# Altium schematic sheet Connectors.SchDoc
size A4; SheetNumber: 1; SheetTotal: 1
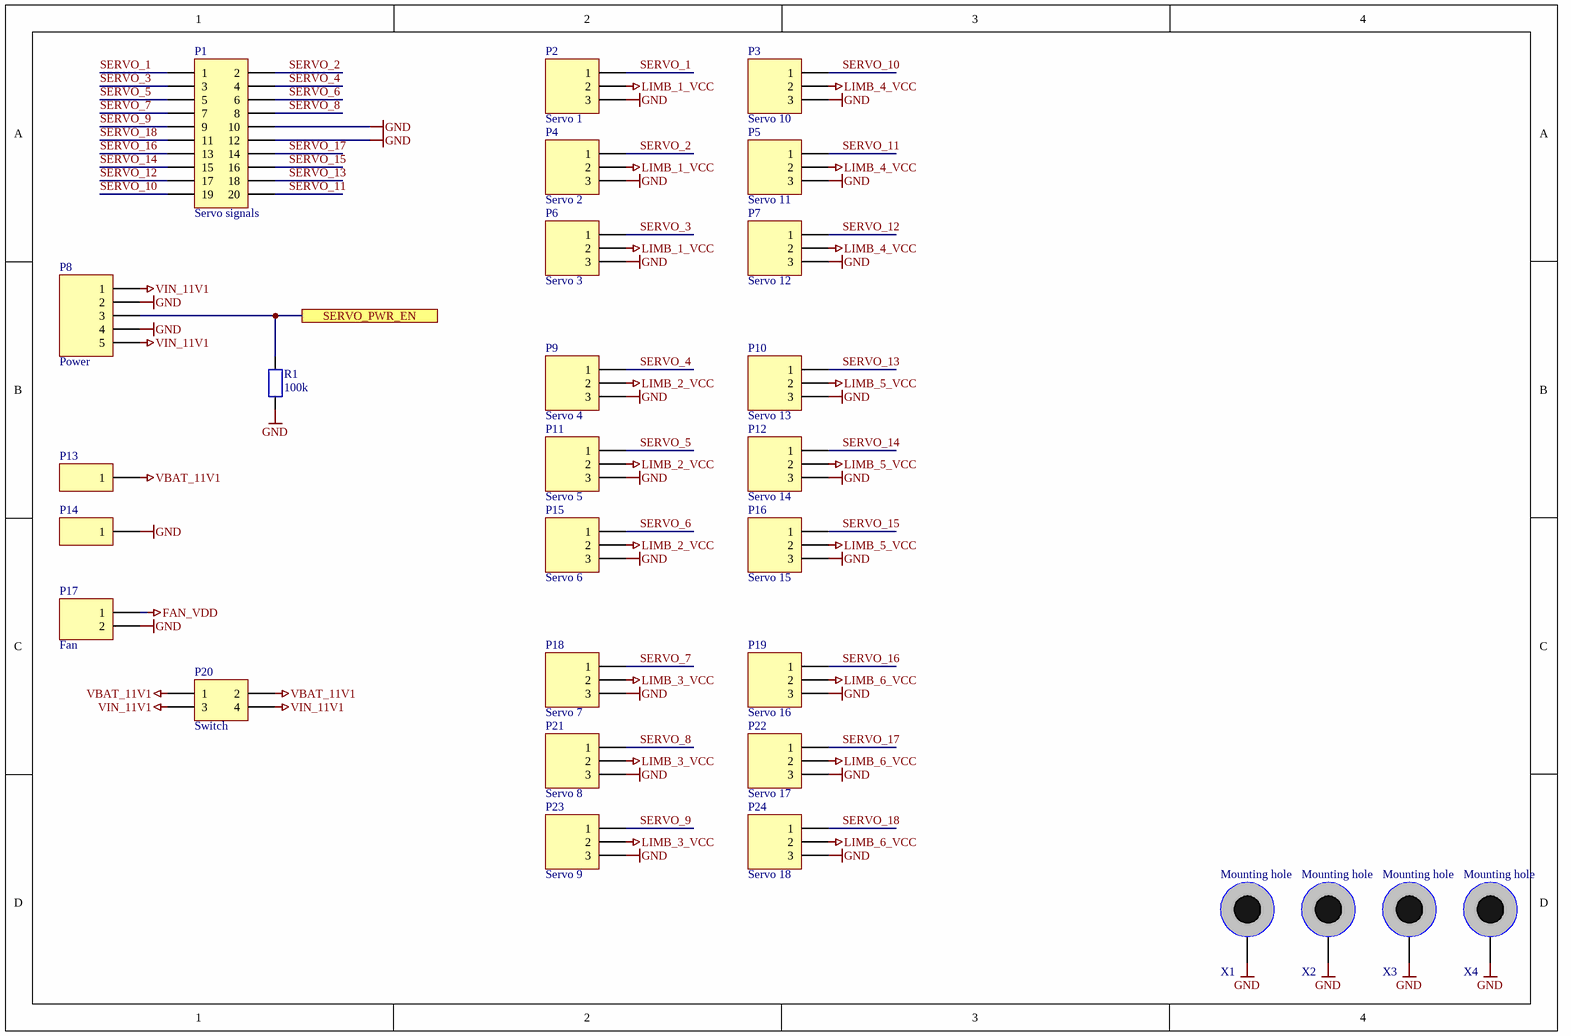
[diagram p0: Connectors.SchDoc]

## Parts
P1  Servo signals  [IDC-20]
P2  Servo 1  [PLS-3 2.54]
P3  Servo 10  [PLS-3 2.54]
P4  Servo 2  [PLS-3 2.54]
P5  Servo 11  [PLS-3 2.54]
P6  Servo 3  [PLS-3 2.54]
P7  Servo 12  [PLS-3 2.54]
P8  Power  [PLS-5 2.54]
P9  Servo 4  [PLS-3 2.54]
P10  Servo 13  [PLS-3 2.54]
P11  Servo 5  [PLS-3 2.54]
P12  Servo 14  [PLS-3 2.54]
P13  (no value)  [WIRE_SMD_5X5]
P14  (no value)  [WIRE_SMD_5X5]
P15  Servo 6  [PLS-3 2.54]
P16  Servo 15  [PLS-3 2.54]
P17  Fan  [PLS-2 2.54]
P18  Servo 7  [PLS-3 2.54]
P19  Servo 16  [PLS-3 2.54]
P20  Switch  [PLD-2 2.54]
P21  Servo 8  [PLS-3 2.54]
P22  Servo 17  [PLS-3 2.54]
P23  Servo 9  [PLS-3 2.54]
P24  Servo 18  [PLS-3 2.54]
R1  100k  [R_0603/1608]
X1  Mounting hole  [HOLE_M3_D6.0/3.5]  (no BOM)
X2  Mounting hole  [HOLE_M3_D6.0/3.5]  (no BOM)
X3  Mounting hole  [HOLE_M3_D6.0/3.5]  (no BOM)
X4  Mounting hole  [HOLE_M3_D6.0/3.5]  (no BOM)

## Ports
SERVO_PWR_EN

## Nets
FAN_VDD: P17.1
GND: P1.10 P1.12 P2.3 P3.3 P4.3 P5.3 P6.3 P7.3 P8.2 P8.4 P9.3 P10.3 P11.3 P12.3 P14.1 P15.3 P16.3 P17.2 P18.3 P19.3 P21.3 P22.3 P23.3 P24.3 R1.2 X1.1 X2.1 X3.1 X4.1
LIMB_1_VCC: P2.2 P4.2 P6.2
LIMB_2_VCC: P9.2 P11.2 P15.2
LIMB_3_VCC: P18.2 P21.2 P23.2
LIMB_4_VCC: P3.2 P5.2 P7.2
LIMB_5_VCC: P10.2 P12.2 P16.2
LIMB_6_VCC: P19.2 P22.2 P24.2
VBAT_11V1: P13.1 P20.1 P20.2
VIN_11V1: P8.1 P8.5 P20.3 P20.4
SERVO_1: P1.1 P2.1
SERVO_2: P1.2 P4.1
SERVO_3: P1.3 P6.1
SERVO_4: P1.4 P9.1
SERVO_5: P1.5 P11.1
SERVO_6: P1.6 P15.1
SERVO_7: P1.7 P18.1
SERVO_8: P1.8 P21.1
SERVO_9: P1.9 P23.1
SERVO_10: P1.19 P3.1
SERVO_11: P1.20 P5.1
SERVO_12: P1.17 P7.1
SERVO_13: P1.18 P10.1
SERVO_14: P1.15 P12.1
SERVO_15: P1.16 P16.1
SERVO_16: P1.13 P19.1
SERVO_17: P1.14 P22.1
SERVO_18: P1.11 P24.1
SERVO_PWR_EN: P8.3 R1.1 ; port SERVO_PWR_EN

## Library data of the parts
P1 = Header 2x10: Header, 2x10-Pin; LatestRevisionDate: 17-Jul-2002; LatestRevisionNote: Re-released for DXP Platform.; Publisher: Altium Limited
P2-P7 P9-P12 P15 P16 P18 P19 P21-P24 = Header 3: Header, 3-Pin; LatestRevisionDate: 17-Jul-2002; LatestRevisionNote: Re-released for DXP Platform.; Publisher: Altium Limited
P8 = Header 5: Header, 5-Pin; LatestRevisionDate: 17-Jul-2002; LatestRevisionNote: Re-released for DXP Platform.; Publisher: Altium Limited
P13 P14 = Header 1: Header, 1-Pin; LatestRevisionDate: 17-Jul-2002; LatestRevisionNote: Re-released for DXP Platform.; Publisher: Altium Limited
P17 = Header 2: Header, 2-Pin; LatestRevisionDate: 17-Jul-2002; LatestRevisionNote: Re-released for DXP Platform.; Publisher: Altium Limited
P20 = Header 2x2: Header, 2-Pin; LatestRevisionDate: 17-Jul-2002; LatestRevisionNote: Re-released for DXP Platform.; Publisher: Altium Limited
R1 = Resistor
X1-X4 = Mounting hole: Hole for screw M3, outline D6